# Altium schematic sheet LedBlink.SchDoc: Blink led scheme
size A4; Author: Artyom Kornilov; DocumentNumber: 1; Revision: 1; SheetNumber: 1; SheetTotal: 1
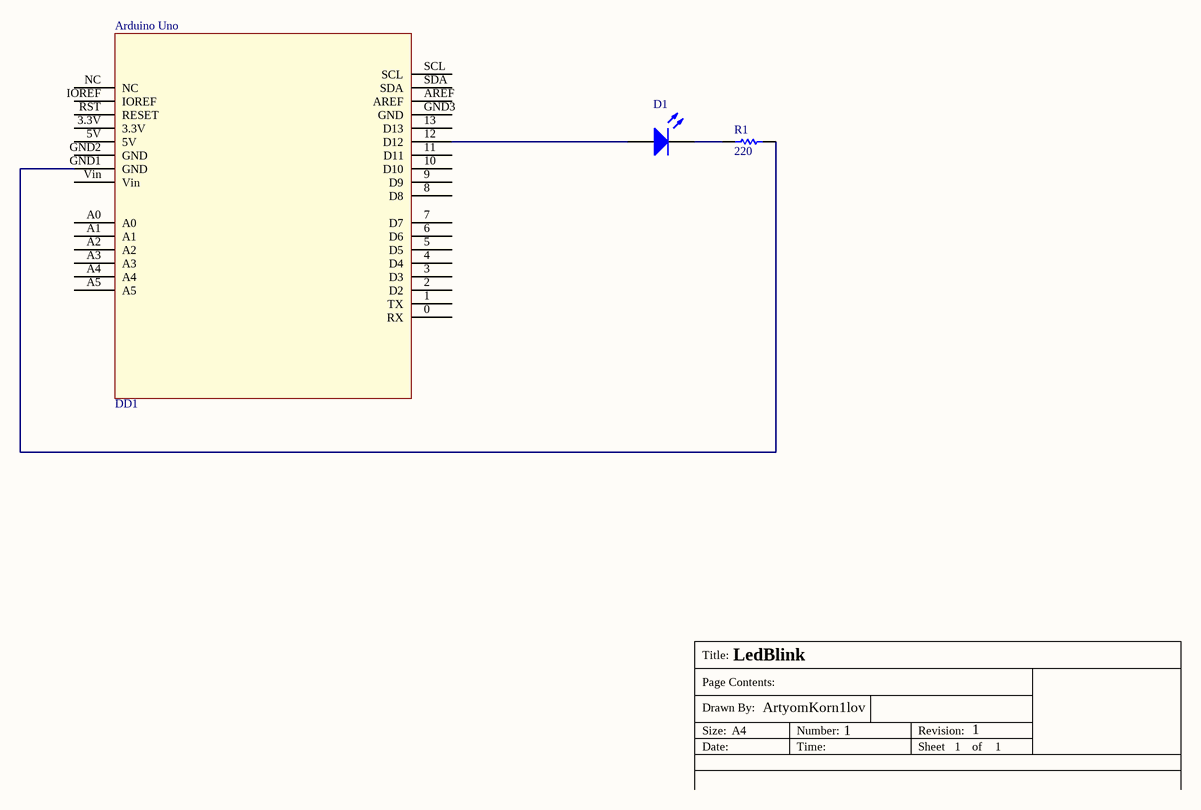
[diagram p0: LedBlink.SchDoc]

## Parts
Arduino_Uno  DD1  [ARDUINO UNO]
D1  Light-Emitting Diode  (value not drawn)
R1  value 220  (hidden comment: Resistor)

## Nets
NetArduino_Uno_12: Arduino_Uno.12(D12) D1.1(A)
NetArduino_Uno_GND1: Arduino_Uno.GND1(GND) R1.2
NetD1_2: D1.2(K) R1.1

Not connected (* = marked no-connect by the designer): Arduino_Uno 0(RX) 1(TX) 2(D2) 3(D3) 3.3V 4(D4) 5(D5) 5V 6(D6) 7(D7) 8(D8) 9(D9) 10(D10) 11(D11) 13(D13) A0 A1 A2 A3 A4 A5 AREF GND2(GND) GND3(GND) IOREF NC RST(RESET) SCL SDA Vin

## Notes on the sheet
- Title:
- Drawn By:
- Page Contents:
- LedBlink
- Size:
- Date:
- A4
- ArtyomKorn1lov
- Number:
- Time:
- 1
- Revision:
- Sheet
- of

## Library data of the parts
Arduino_Uno = ARDUINO UNO
D1 = LED: AF: 1; BV: 0; BV_MAX: 1e99; EG: 1.11; FC: 0.5; IBV: 0.001; IS: 1e-14; MJSW: 0.33; NTUN: 30; TNOM: 27; XTI: 3; SimulationGenericComponent: True; CJO: 0; CJP: 0; CTA: 0; CTP: 0; FCS: 0.5; FV_MAX: 1e99; IKF: 0; IKR: 0; ISR: 1e-14; JSW: 0; JTUN: 0; JTUNSW: 0; KEG: 1; KF: 0; LEVEL: 1; N: 1; NBV: 1; NR: 1; NS: 1; PHP: 1; RS: 0; TCV: 0; TLEV: 0; TLEVC: 0; TM1: 0; TM2: 0; TPB: 0; TPHP: 0; TRS: 0; TRS2: 0; TT: 0; TTT1: 0; TTT2: 0; VJ: 1; XTITUN: 3
R1 = Resistor: TC1: 0; SimulationGenericComponent: True; TC2: 0